# Altium schematic sheet mcu.SchDoc: FastIC+ readout
size 420 x 297 mm; CheckedBy: Jerome A. Alozy; CompanyName: CERN; DrawnBy: Vojtech Vosahlo; Organization: CERN; Address1: European Organization for Nuclear Research; Address2: CH-1211 Genève 23 - Switzerland; SheetNumber: 6; SheetTotal: 6; Projet: Fast Timing; DivGrp: EP-ESE; Designer: Vojtech Vosahlo; ModifiedDate: -
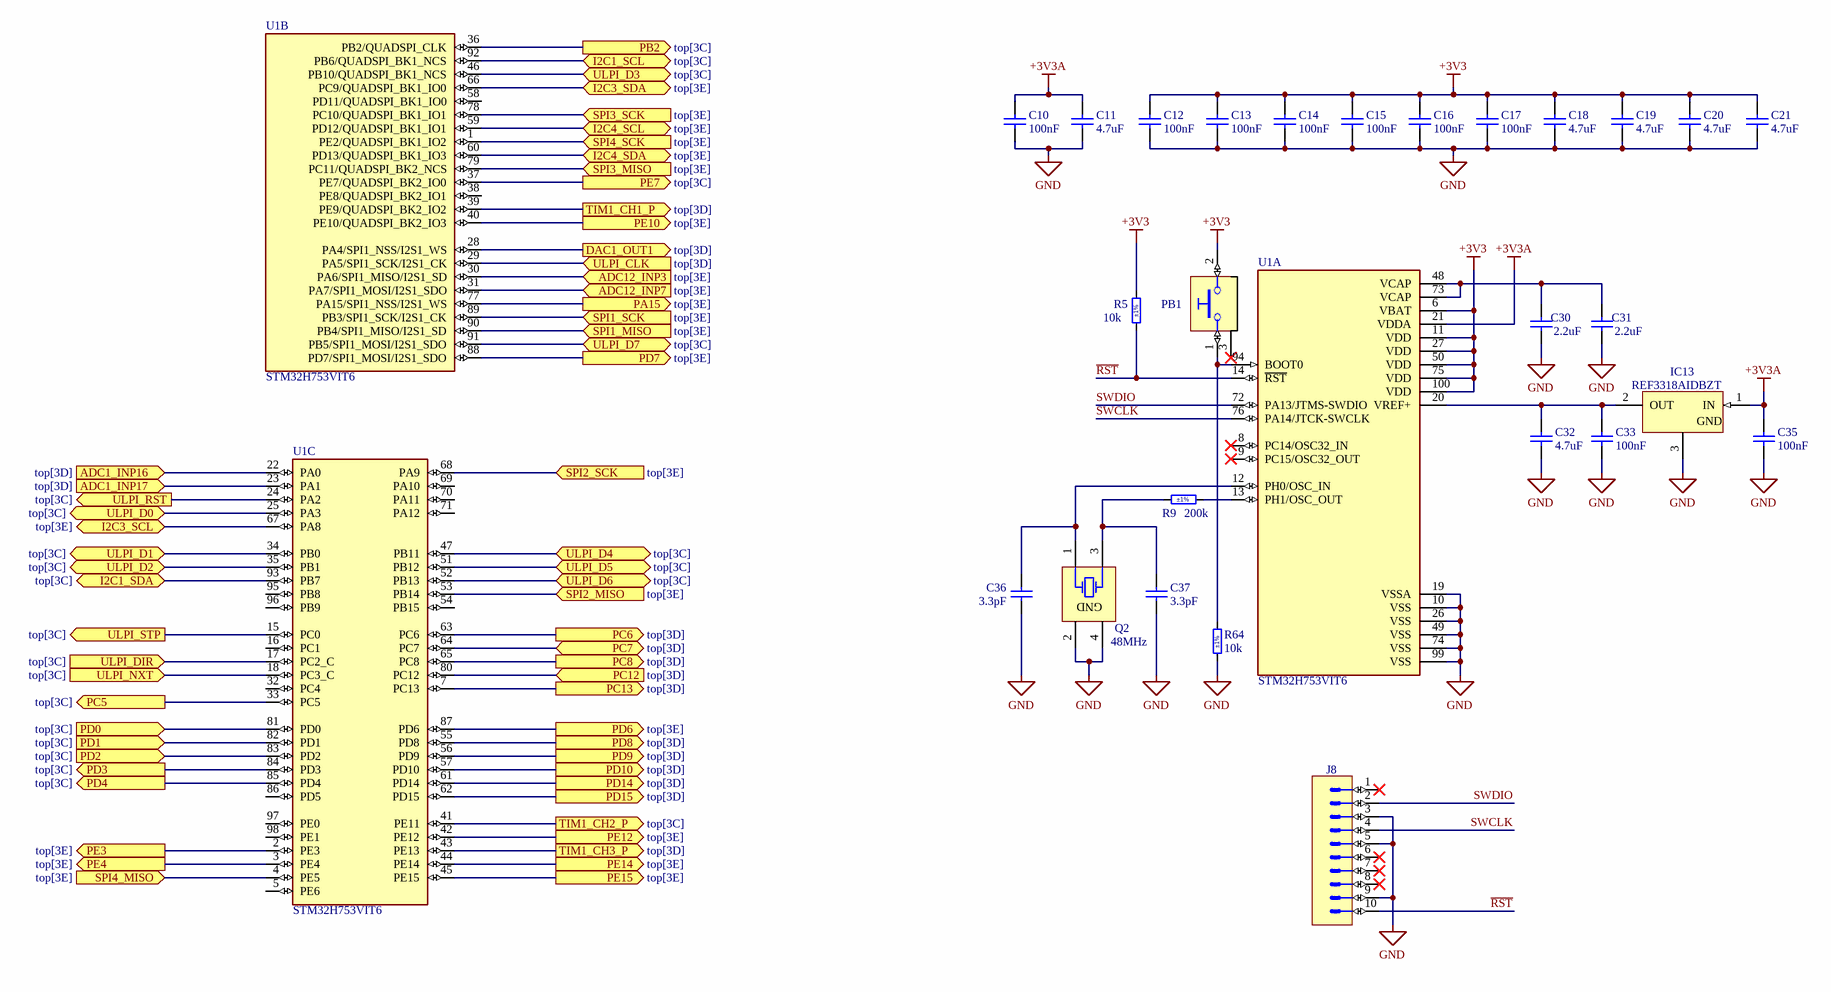
[diagram p0: mcu.SchDoc]

## Parts
C10  100nF  [CAPC1005X55N]
C11  4.7uF  [CAPC1608X87N]
C12  100nF  [CAPC1005X55N]
C13  100nF  [CAPC1005X55N]
C14  100nF  [CAPC1005X55N]
C15  100nF  [CAPC1005X55N]
C16  100nF  [CAPC1005X55N]
C17  100nF  [CAPC1005X55N]
C18  4.7uF  [CAPC1608X87N]
C19  4.7uF  [CAPC1608X87N]
C20  4.7uF  [CAPC1608X87N]
C21  4.7uF  [CAPC1608X87N]
C30  2.2uF  [CAPC1608X90N]
C31  2.2uF  [CAPC1608X90N]
C32  4.7uF  [CAPC1608X87N]
C33  100nF  [CAPC1005X55N]
C35  100nF  [CAPC1005X55N]
C36  3.3pF  [CAPC1005X55N]
C37  3.3pF  [CAPC1005X55N]
IC13  REF3318AIDBZT  [SOT95P237X112-3N]
J8  Header 10  [SAMTEC_FTSH-105-01-L-DV-K]  (value not drawn)
PB1  Push Button  [PB_OMRON_B3U-1100P]  (value not drawn)
Q2  48MHz  [XTAL_KYOCERA_CX3225SB]
R5  10k  Tolerance: ±1%  [RESC1005X40N]
R9  200k  Tolerance: ±1%  [RESC1005X40N]
R64  10k  Tolerance: ±1%  [RESC1005X40N]
U1  STM32H753VIT6  [QFP50P1600X1600X160-100N]  (parts A,B,C of 3)

## Ports
ADC1_INP16 (in, see top[3D]), ADC1_INP17 (in, see top[3D]), ADC12_INP3 (in, see top[3E]), ADC12_INP7 (in, see top[3E]), DAC1_OUT1 (out, see top[3D]), I2C1_SCL (bidir, see top[3C]), I2C1_SDA (bidir, see top[3C]), I2C3_SCL (bidir, see top[3E]), I2C3_SDA (bidir, see top[3E]), I2C4_SCL (bidir, see top[3E]), I2C4_SDA (bidir, see top[3E]), PA15 (out, see top[3E]), PB2 (out, see top[3C]), PC5 (out, see top[3C]), PC6 (out, see top[3D]), PC7 (bidir, see top[3D]), PC8 (out, see top[3D]), PC12 (in, see top[3D]), PC13 (out, see top[3D]), PD0 (in, see top[3C]), PD1 (in, see top[3C]), PD2 (in, see top[3C]), PD3 (out, see top[3C]), PD4 (out, see top[3C]), PD6 (out, see top[3E]), PD7 (out, see top[3E]), PD8 (out, see top[3D]), PD9 (out, see top[3D]), PD10 (out, see top[3D]), PD14 (out, see top[3D]), PD15 (out, see top[3D]), PE3 (out, see top[3E]), PE4 (out, see top[3E]), PE7 (out, see top[3C]), PE10 (out, see top[3E]), PE12 (out, see top[3E]), PE14 (out, see top[3E]), PE15 (out, see top[3E]), SPI1_MISO (in, see top[3E]), SPI1_SCK (in, see top[3E]), SPI2_MISO (in, see top[3E]), SPI2_SCK (in, see top[3E]), SPI3_MISO (in, see top[3E]), SPI3_SCK (in, see top[3E]), SPI4_MISO (in, see top[3E]), SPI4_SCK (in, see top[3E]), TIM1_CH1_P (out, see top[3D]), TIM1_CH2_P (out, see top[3C]), TIM1_CH3_P (out, see top[3D]), ULPI_CLK (in, see top[3D]), ULPI_D0 (bidir, see top[3C]), ULPI_D1 (bidir, see top[3C]), ULPI_D2 (bidir, see top[3C]), ULPI_D3 (bidir, see top[3C]), ULPI_D4 (bidir, see top[3C]), ULPI_D5 (bidir, see top[3C]), ULPI_D6 (bidir, see top[3C]), ULPI_D7 (bidir, see top[3C]), ULPI_DIR (in, see top[3C]), ULPI_NXT (in, see top[3C]), ULPI_RST (out, see top[3C]), ULPI_STP (out, see top[3C])

## Nets
+3V3: C12.1 C13.1 C14.1 C15.1 C16.1 C17.1 C18.1 C19.1 C20.1 C21.1 PB1.2 R5.2 U1.6(VBAT) U1.11(VDD) U1.27(VDD) U1.50(VDD) U1.75(VDD) U1.100(VDD)
+3V3A: C10.1 C11.1 C35.1 IC13.1(IN) U1.21(VDDA)
GND: C10.2 C11.2 C12.2 C13.2 C14.2 C15.2 C16.2 C17.2 C18.2 C19.2 C20.2 C21.2 C30.1 C31.1 C32.2 C33.2 C35.2 C36.1 C37.1 IC13.3(GND) J8.3 J8.5 J8.9 Q2.2(GND) Q2.4(GND) R64.1 U1.10(VSS) U1.19(VSSA) U1.26(VSS) U1.49(VSS) U1.74(VSS) U1.99(VSS)
~{RST}: J8.10 R5.1 U1.14(~{RST})
ADC1_INP16: U1.22(PA0) ; port ADC1_INP16
ADC1_INP17: U1.23(PA1) ; port ADC1_INP17
ADC12_INP3: U1.30(PA6/SPI1_MISO/I2S1_SD) ; port ADC12_INP3
ADC12_INP7: U1.31(PA7/SPI1_MOSI/I2S1_SDO) ; port ADC12_INP7
DAC1_OUT1: U1.28(PA4/SPI1_NSS/I2S1_WS) ; port DAC1_OUT1
I2C1_SCL: U1.92(PB6/QUADSPI_BK1_NCS) ; port I2C1_SCL
I2C1_SDA: U1.93(PB7) ; port I2C1_SDA
I2C3_SCL: U1.67(PA8) ; port I2C3_SCL
I2C3_SDA: U1.66(PC9/QUADSPI_BK1_IO0) ; port I2C3_SDA
I2C4_SCL: U1.59(PD12/QUADSPI_BK1_IO1) ; port I2C4_SCL
I2C4_SDA: U1.60(PD13/QUADSPI_BK1_IO3) ; port I2C4_SDA
PA15: U1.77(PA15/SPI1_NSS/I2S1_WS) ; port PA15
PB2: U1.36(PB2/QUADSPI_CLK) ; port PB2
PC5: U1.33(PC5) ; port PC5
PC6: U1.63(PC6) ; port PC6
PC7: U1.64(PC7) ; port PC7
PC8: U1.65(PC8) ; port PC8
PC12: U1.80(PC12) ; port PC12
PC13: U1.7(PC13) ; port PC13
PD0: U1.81(PD0) ; port PD0
PD1: U1.82(PD1) ; port PD1
PD2: U1.83(PD2) ; port PD2
PD3: U1.84(PD3) ; port PD3
PD4: U1.85(PD4) ; port PD4
PD6: U1.87(PD6) ; port PD6
PD7: U1.88(PD7/SPI1_MOSI/I2S1_SDO) ; port PD7
PD8: U1.55(PD8) ; port PD8
PD9: U1.56(PD9) ; port PD9
PD10: U1.57(PD10) ; port PD10
PD14: U1.61(PD14) ; port PD14
PD15: U1.62(PD15) ; port PD15
PE3: U1.2(PE3) ; port PE3
PE4: U1.3(PE4) ; port PE4
PE7: U1.37(PE7/QUADSPI_BK2_IO0) ; port PE7
PE10: U1.40(PE10/QUADSPI_BK2_IO3) ; port PE10
PE12: U1.42(PE12) ; port PE12
PE14: U1.44(PE14) ; port PE14
PE15: U1.45(PE15) ; port PE15
SPI1_MISO: U1.90(PB4/SPI1_MISO/I2S1_SD) ; port SPI1_MISO
SPI1_SCK: U1.89(PB3/SPI1_SCK/I2S1_CK) ; port SPI1_SCK
SPI2_MISO: U1.53(PB14) ; port SPI2_MISO
SPI2_SCK: U1.68(PA9) ; port SPI2_SCK
SPI3_MISO: U1.79(PC11/QUADSPI_BK2_NCS) ; port SPI3_MISO
SPI3_SCK: U1.78(PC10/QUADSPI_BK1_IO1) ; port SPI3_SCK
SPI4_MISO: U1.4(PE5) ; port SPI4_MISO
SPI4_SCK: U1.1(PE2/QUADSPI_BK1_IO2) ; port SPI4_SCK
SWCLK: J8.4 U1.76(PA14/JTCK-SWCLK)
SWDIO: J8.2 U1.72(PA13/JTMS-SWDIO)
TIM1_CH1_P: U1.39(PE9/QUADSPI_BK2_IO2) ; port TIM1_CH1_P
TIM1_CH2_P: U1.41(PE11) ; port TIM1_CH2_P
TIM1_CH3_P: U1.43(PE13) ; port TIM1_CH3_P
ULPI_CLK: U1.29(PA5/SPI1_SCK/I2S1_CK) ; port ULPI_CLK
ULPI_D0: U1.25(PA3) ; port ULPI_D0
ULPI_D1: U1.34(PB0) ; port ULPI_D1
ULPI_D2: U1.35(PB1) ; port ULPI_D2
ULPI_D3: U1.46(PB10/QUADSPI_BK1_NCS) ; port ULPI_D3
ULPI_D4: U1.47(PB11) ; port ULPI_D4
ULPI_D5: U1.51(PB12) ; port ULPI_D5
ULPI_D6: U1.52(PB13) ; port ULPI_D6
ULPI_D7: U1.91(PB5/SPI1_MOSI/I2S1_SDO) ; port ULPI_D7
ULPI_DIR: U1.17(PC2_C) ; port ULPI_DIR
ULPI_NXT: U1.18(PC3_C) ; port ULPI_NXT
ULPI_RST: U1.24(PA2) ; port ULPI_RST
ULPI_STP: U1.15(PC0) ; port ULPI_STP
NetC30_2: C30.2 C31.2 U1.48(VCAP) U1.73(VCAP)
NetC32_1: C32.1 C33.1 IC13.2(OUT) U1.20(VREF+)
NetC36_2: C36.2 Q2.1(X) U1.12(PH0/OSC_IN)
NetC37_2: C37.2 Q2.3(X) R9.1
NetPB1_1: PB1.1 R64.2 U1.94(BOOT0)
NetR9_2: R9.2 U1.13(PH1/OSC_OUT)

Not connected (* = marked no-connect by the designer): J8 1* 6* 7* 8*; PB1 3*; U1 5(PE6) 8(PC14/OSC32_IN)* 9(PC15/OSC32_OUT)* 16(PC1) 32(PC4) 38(PE8/QUADSPI_BK2_IO1) 54(PB15) 58(PD11/QUADSPI_BK1_IO0) 69(PA10) 70(PA11) 71(PA12) 86(PD5) 95(PB8) 96(PB9) 97(PE0) 98(PE1)

## Notes on the sheet
- Project/Equipment
- Document
- Designer
- Drawn by
- Check.by
- File
- Last Mod.
- Print Date
- Sheet
- Size
- A3
- of
- Rev

## Library data of the parts
C10 C12-C17 C33 C35 = CC0402_100NF_16V_10%_X7R: Non-polarised capacitor; Part Description: SMD Multilayer Chip Ceramic Capacitor; Manufacturer: GENERIC; Manufacturer1 Part Number: GRM155R71C104KA88D; Voltage: 16V; TC: X7R; Tolerance: ±10%; Part Number: CC0402_100NF_16V_10%_X7R; Component Kind: Standard; Component Type: Standard; Pin Count: 2; Value: 100nF; Status: Not Recommended; Manufacturer Part Number: CC0402_100NF_16V_10%_X7R; Case: 0402; Mounted: Yes; Socket: No; SMD: Yes; Sense: No; HelpURL: \\cern.ch\dfs\Applications\Altium\Datasheets\CC0402_X7R_MURATA_GRM.pdf; Author: CERN DEM JLC; CreateDate: 05/12/2013; LatestRevisionDate: 03/12/2007; Manufacturer1 Example: MURATA; Manufacturer1 ComponentHeight: 0.55mm
C11 C18-C21 C32 = CC0603_4.7UF_6.3V_10%_X5R: Non-polarised capacitor; Part Description: SMD Multilayer Chip Ceramic Capacitor; Manufacturer: GENERIC; Manufacturer1 Part Number: 225520613672; Voltage: 6.3V; TC: X5R; Tolerance: ±10%; Part Number: CC0603_4.7UF_6.3V_10%_X5R; Component Kind: Standard; Component Type: Standard; Pin Count: 2; Value: 4.7uF; Status: Preferred; Manufacturer Part Number: CC0603_4.7UF_6.3V_10%_X5R; Case: 0603; Mounted: Yes; Socket: No; SMD: Yes; Sense: No; Manufacturer1 Example: PHYCOMP; Manufacturer1 ComponentHeight: 0.87mm; HelpURL: \\cern.ch\dfs\Applications\Altium\Datasheets\CC0805_X5R_PHYCOMP_HC.pdf; Author: CERN DEM JLC; CreateDate: 03/12/2007; LatestRevisionDate: 03/12/2007
C30 C31 = CC0603_2.2UF_10V_20%_X7R: Non-polarised capacitor; Part Description: SMD Multilayer Chip Ceramic Capacitor; Manufacturer: GENERIC; Manufacturer1 Part Number: LMK107B7225MA-T; Voltage: 10V; TC: X7R; Tolerance: ±20%; Part Number: CC0603_2.2UF_10V_20%_X7R; Component Kind: Standard; Component Type: Standard; Pin Count: 2; Value: 2.2uF; Status: Not Recommended; Manufacturer Part Number: CC0603_2.2UF_10V_20%_X7R; Case: 0603; Mounted: Yes; Socket: No; SMD: Yes; Sense: No; Manufacturer1 Example: TAIYO YUDEN; Manufacturer1 ComponentHeight: 0.9mm; HelpURL: \\cern.ch\dfs\Applications\Altium\Datasheets\CC0603_X7R_TAIYO-YUDEN_HIGH-VALUE.pdf; Author: CERN DEM JLC; CreateDate: 6/22/2011; LatestRevisionDate: 6/27/2011
C36 C37 = CC0402_3.3PF_50V_0.25PF_C0G: Non-polarised capacitor; Part Description: SMD Multilayer Chip Ceramic Capacitor; Manufacturer: GENERIC; Manufacturer1 Part Number: C0402C339C5GACTU; Voltage: 50V; TC: C0G/NP0; Tolerance: ±0.25pF; Part Number: CC0402_3.3PF_50V_0.25PF_C0G; Component Kind: Standard; Component Type: Standard; Pin Count: 2; Value: 3.3pF; Status: Preferred; Manufacturer Part Number: CC0402_3.3PF_50V_0.25PF_C0G; Case: 0402; Mounted: Yes; Socket: No; SMD: Yes; Sense: No; Manufacturer1 Example: KEMET; Manufacturer1 ComponentHeight: 0.55mm; HelpURL: \\cern.ch\dfs\Applications\Altium\Datasheets\CC0402_C0G_KEMET_(Commercial Grade).pdf; Author: CERN DEM JLC; CreateDate: 12/3/2007; LatestRevisionDate: 4/22/2015
IC13 = REF3318AIDBZT: 3-Terminal Regulator 1=IN 2=OUT 3=GND; Part Description: 1.8V, 30ppm/°C Drift, 3.9uA, Voltage Reference; Manufacturer: TEXAS INSTRUMENTS; PressFit: No; Bonding: No; Part Number: REF3318AIDBZT; Component Kind: Standard; Component Type: Standard; Device: REF3318AIDBZT; PackageDescription: SOT, 0.95mm Pitch; 3 Pin, 1.30mm W X 2.92mm L X 1.12mm H body, IPC Medium Density; Manufacturer Part Number: REF3318AIDBZT; Pin Count: 3; Case: SOT23-3; Mounted: Yes; Socket: No; SMD: Yes; Sense: No; ComponentHeight: 1.12mm; HelpURL: \\cern.ch\dfs\Applications\Altium\Datasheets\REF3318AIDBZT.pdf; Author: CERN DEM JLC; CreateDate: 6/20/2011; LatestRevisionDate: 6/20/2011
J8 = SAMTEC_FTSH-105-01-L-DV-K: Connector 10 Male; Part Description: 10 Contacts, Pitch 1.27mm, Dual Row Straight Shrouded SMT Micro Header with Keying Shroud; Manufacturer: SAMTEC; PressFit: No; Part Number: SAMTEC_FTSH-105-01-L-DV-K; Component Kind: Standard; Component Type: Standard; Pin Count: 10; Family: Header 10; Mounted: Yes; Socket: No; SMD: Yes; Sense: No; Status: None; Manufacturer Part Number: FTSH-105-01-L-DV-K; ComponentHeight: 6.25mm; HelpURL: \\cern.ch\dfs\Applications\Altium\Datasheets\SAMTEC_FTSH-105-01-L-DV-K.pdf; Author: CERN DEM BC; CreateDate: 1/17/2020; LatestRevisionDate: 1/17/2020
PB1 = PB_OMRON_B3U-1100P: Push-Button Switch SPST; Part Description: 3x2.5mm Ultra-Small Tactile SPST Pushbutton Switch (with Ground Terminal),Contact Rating 50mA 12VDC, B3U Series; Manufacturer: OMRON; PressFit: No; Part Number: PB_OMRON_B3U-1100P; Component Kind: Standard; Component Type: Standard; Pin Count: 3; PackageDescription: Body 1.2x3x2.5mm Ultra-Small Tactile SPST Pushbutton Switch, (with Ground Terminal), OMRON B3U Series; Family: Push Button; Mounted: Yes; Socket: No; SMD: Yes; Sense: No; Status: None; Manufacturer Part Number: B3U-1100P; ComponentHeight: 1.75mm; HelpURL: \\cern.ch\dfs\Applications\Altium\Datasheets\PB_OMRON_B3U-1100P.pdf; Author: CERN DEM JLC; CreateDate: 3/16/2010; LatestRevisionDate: 6/16/2022
Q2 = XTAL_48MHZ_KYOCERA_CX3225SB48000D0FPJC1: Crystal 4 pins 1=XTAL Control 2=GND3=XTAL 4=GND; Part Description: Tolerance: ±10ppm, Stability: ±15ppm, 8pF, -40°C to +85°C, Surface Mount Crystal; PressFit: No; Bonding: No; Part Number: XTAL_48MHZ_KYOCERA_CX3225SB48000D0FPJC1; Component Kind: Standard; Component Type: Standard; PackageDescription: SMD Crystal Kyocera, 4 Pins, 2.50mm L X 3.20mm W X 0.6mm H; Value: 48MHz; Manufacturer: KYOCERA; Manufacturer Part Number: CX3225SB48000D0FPJC1; Pin Count: 4; Mounted: Yes; Socket: No; SMD: Yes; Sense: No; ComponentHeight: 0.6mm; HelpURL: \\cern.ch\dfs\Applications\Altium\Datasheets\XTAL_KYOCERA_CX3225SB.pdf; Author: CERN DEM JLC; CreateDate: 6/5/2018; LatestRevisionDate: 6/5/2018
R5 R64 = R0402_10K_1%_0.0625W_100PPM: Resistor - 1%; Part Description: General Purpose Thick Film Chip Resistor; Manufacturer: GENERIC; Manufacturer1 Part Number: 232270671003L; TC: ±100ppm/°C; PressFit: No; Part Number: R0402_10K_1%_0.0625W_100PPM; Component Kind: Standard; Component Type: Standard; Pin Count: 2; Value: 10k; Status: Not Recommended; Power: 0.0625W; Manufacturer Part Number: R0402_10K_1%_0.0625W_100PPM; Case: 0402; Mounted: Yes; Sense: No; Socket: No; SMD: Yes; Manufacturer1 Example: YAGEO PHYCOMP; Manufacturer1 ComponentHeight: 0.4mm; HelpURL: \\cern.ch\dfs\Applications\Altium\Datasheets\R0402_Phycomp_RC0402.pdf; Author: CERN DEM JLC; CreateDate: 12/3/2007; LatestRevisionDate: 10/17/2012
R9 = R0402_200K_1%_0.0625W_100PPM: Resistor - 1%; Part Description: General Purpose Thick Film Chip Resistor; Manufacturer: GENERIC; Manufacturer1 Part Number: 232270672004L; TC: ±100ppm/°C; PressFit: No; Part Number: R0402_200K_1%_0.0625W_100PPM; Component Kind: Standard; Component Type: Standard; Pin Count: 2; Value: 200k; Status: Not Recommended; Power: 0.0625W; Manufacturer Part Number: R0402_200K_1%_0.0625W_100PPM; Case: 0402; Mounted: Yes; Sense: No; Socket: No; SMD: Yes; Manufacturer1 Example: YAGEO PHYCOMP; Manufacturer1 ComponentHeight: 0.4mm; HelpURL: \\cern.ch\dfs\Applications\Altium\Datasheets\R0402_Phycomp_RC0402.pdf; Author: CERN DEM JLC; CreateDate: 12/3/2007; LatestRevisionDate: 10/17/2012
U1 = STM32H753VIT6: ARMÂ® CortexÂ®-M7 STM32H7 Microcontroller IC 32-Bit 480MHz 2MB _2M x 8_ FLASH 100-LQFP _14x14_; MF: STMicroelectronics; MP: STM32H753VIT6; Availability: Unavailable; SnapEDA_Link: https://www.snapeda.com/parts/STM32H753VIT6/STMicroelectronics/view-part/2770314/?ref=snap; Value: *; Package: LQFP-100 STMicroelectronics; Price: None